# EAGLE schematic pp_mainframe (EAGLE 9.0.0)
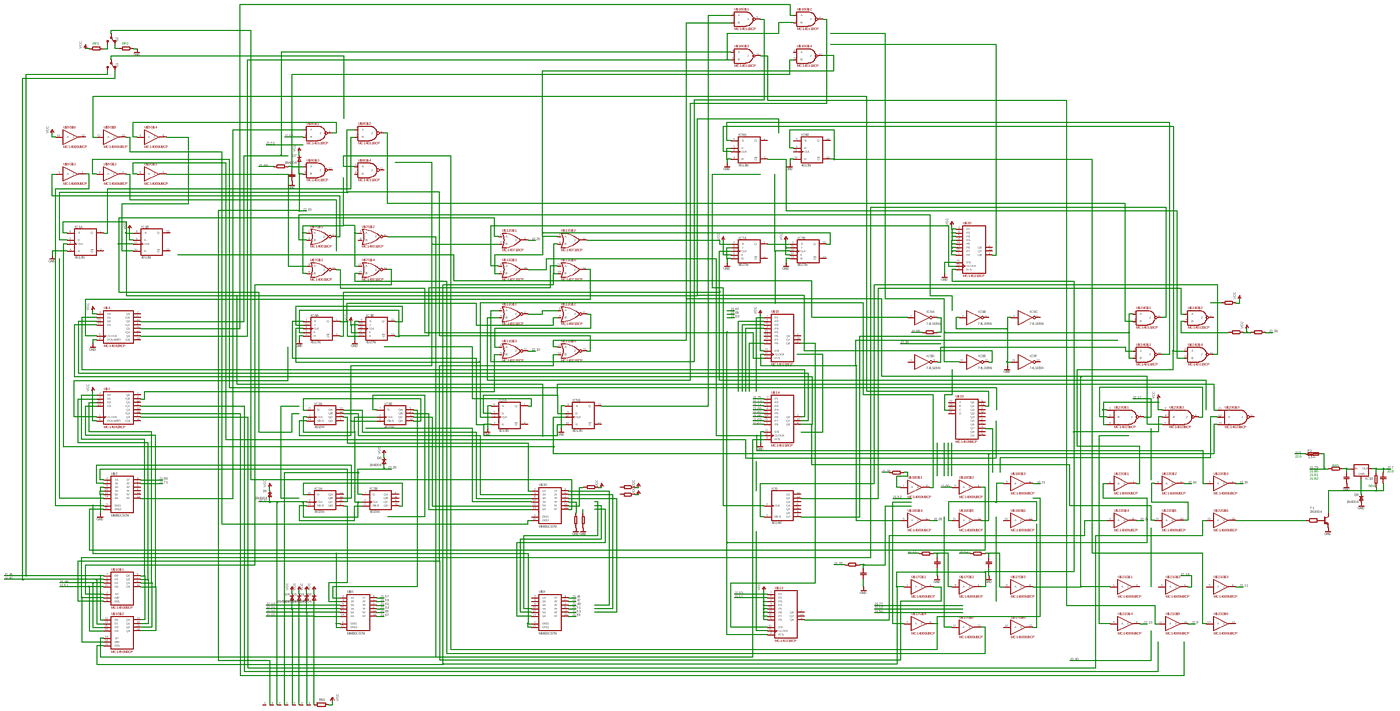
[diagram p0: schematic, sheet 1, overview]
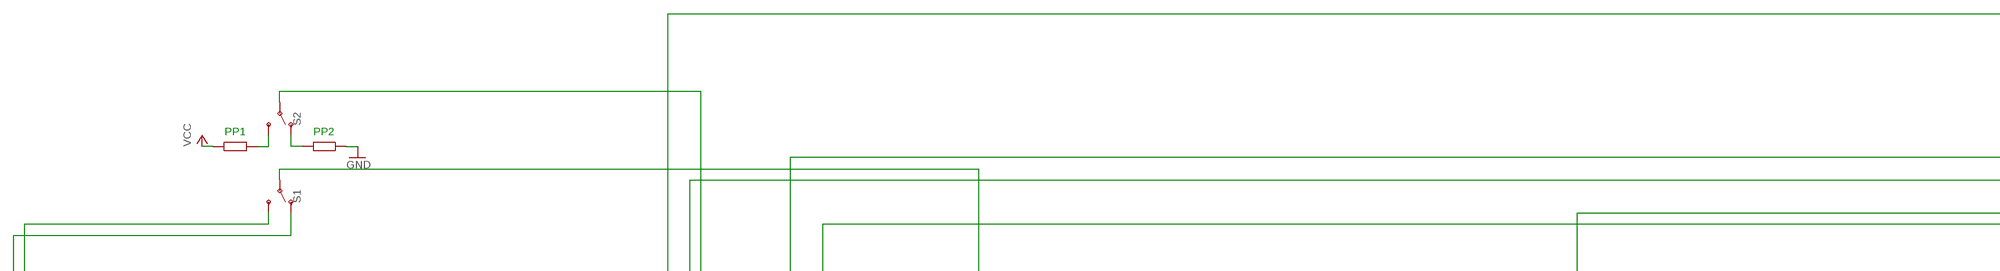
[diagram p1: schematic, sheet 1, part 1 of 5]
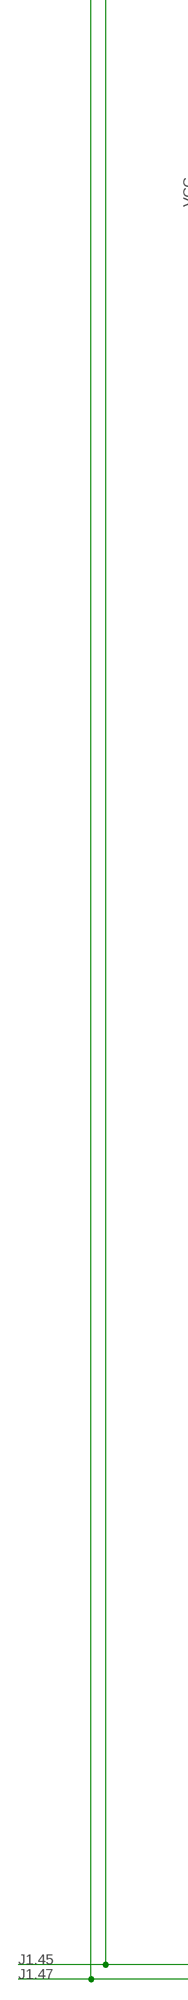
[diagram p2: schematic, sheet 1, part 2 of 5]
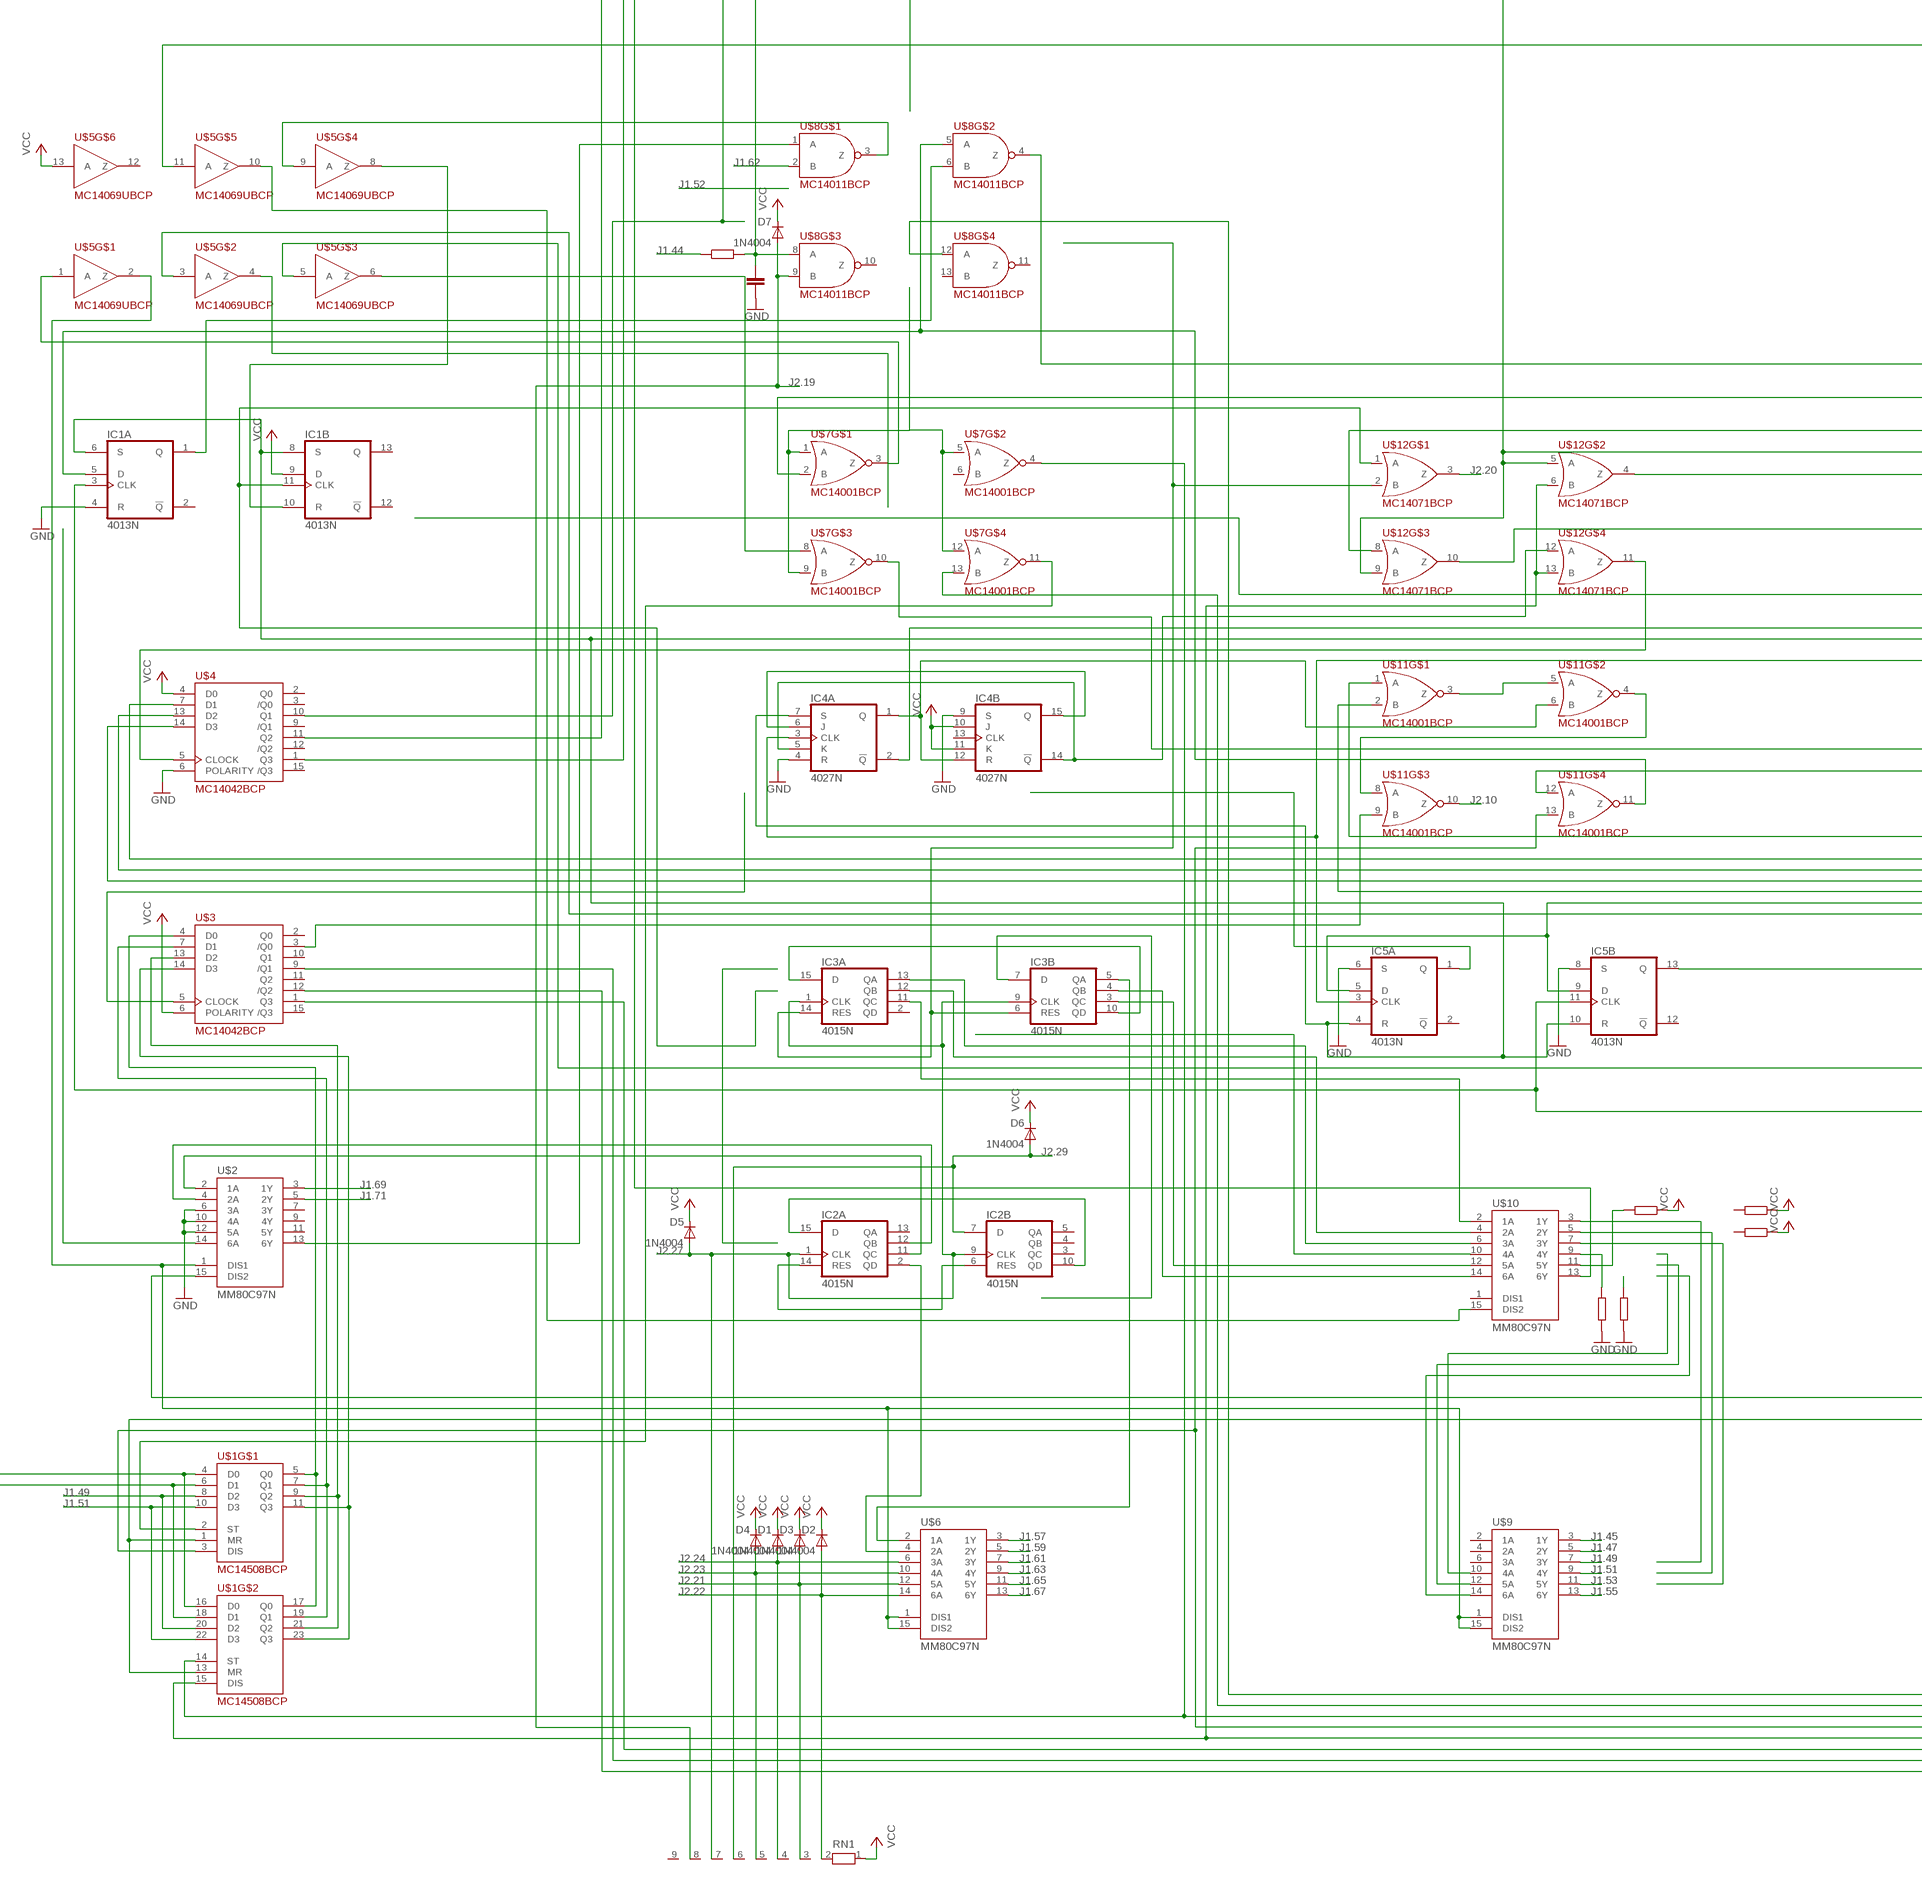
[diagram p3: schematic, sheet 1, part 3 of 5]
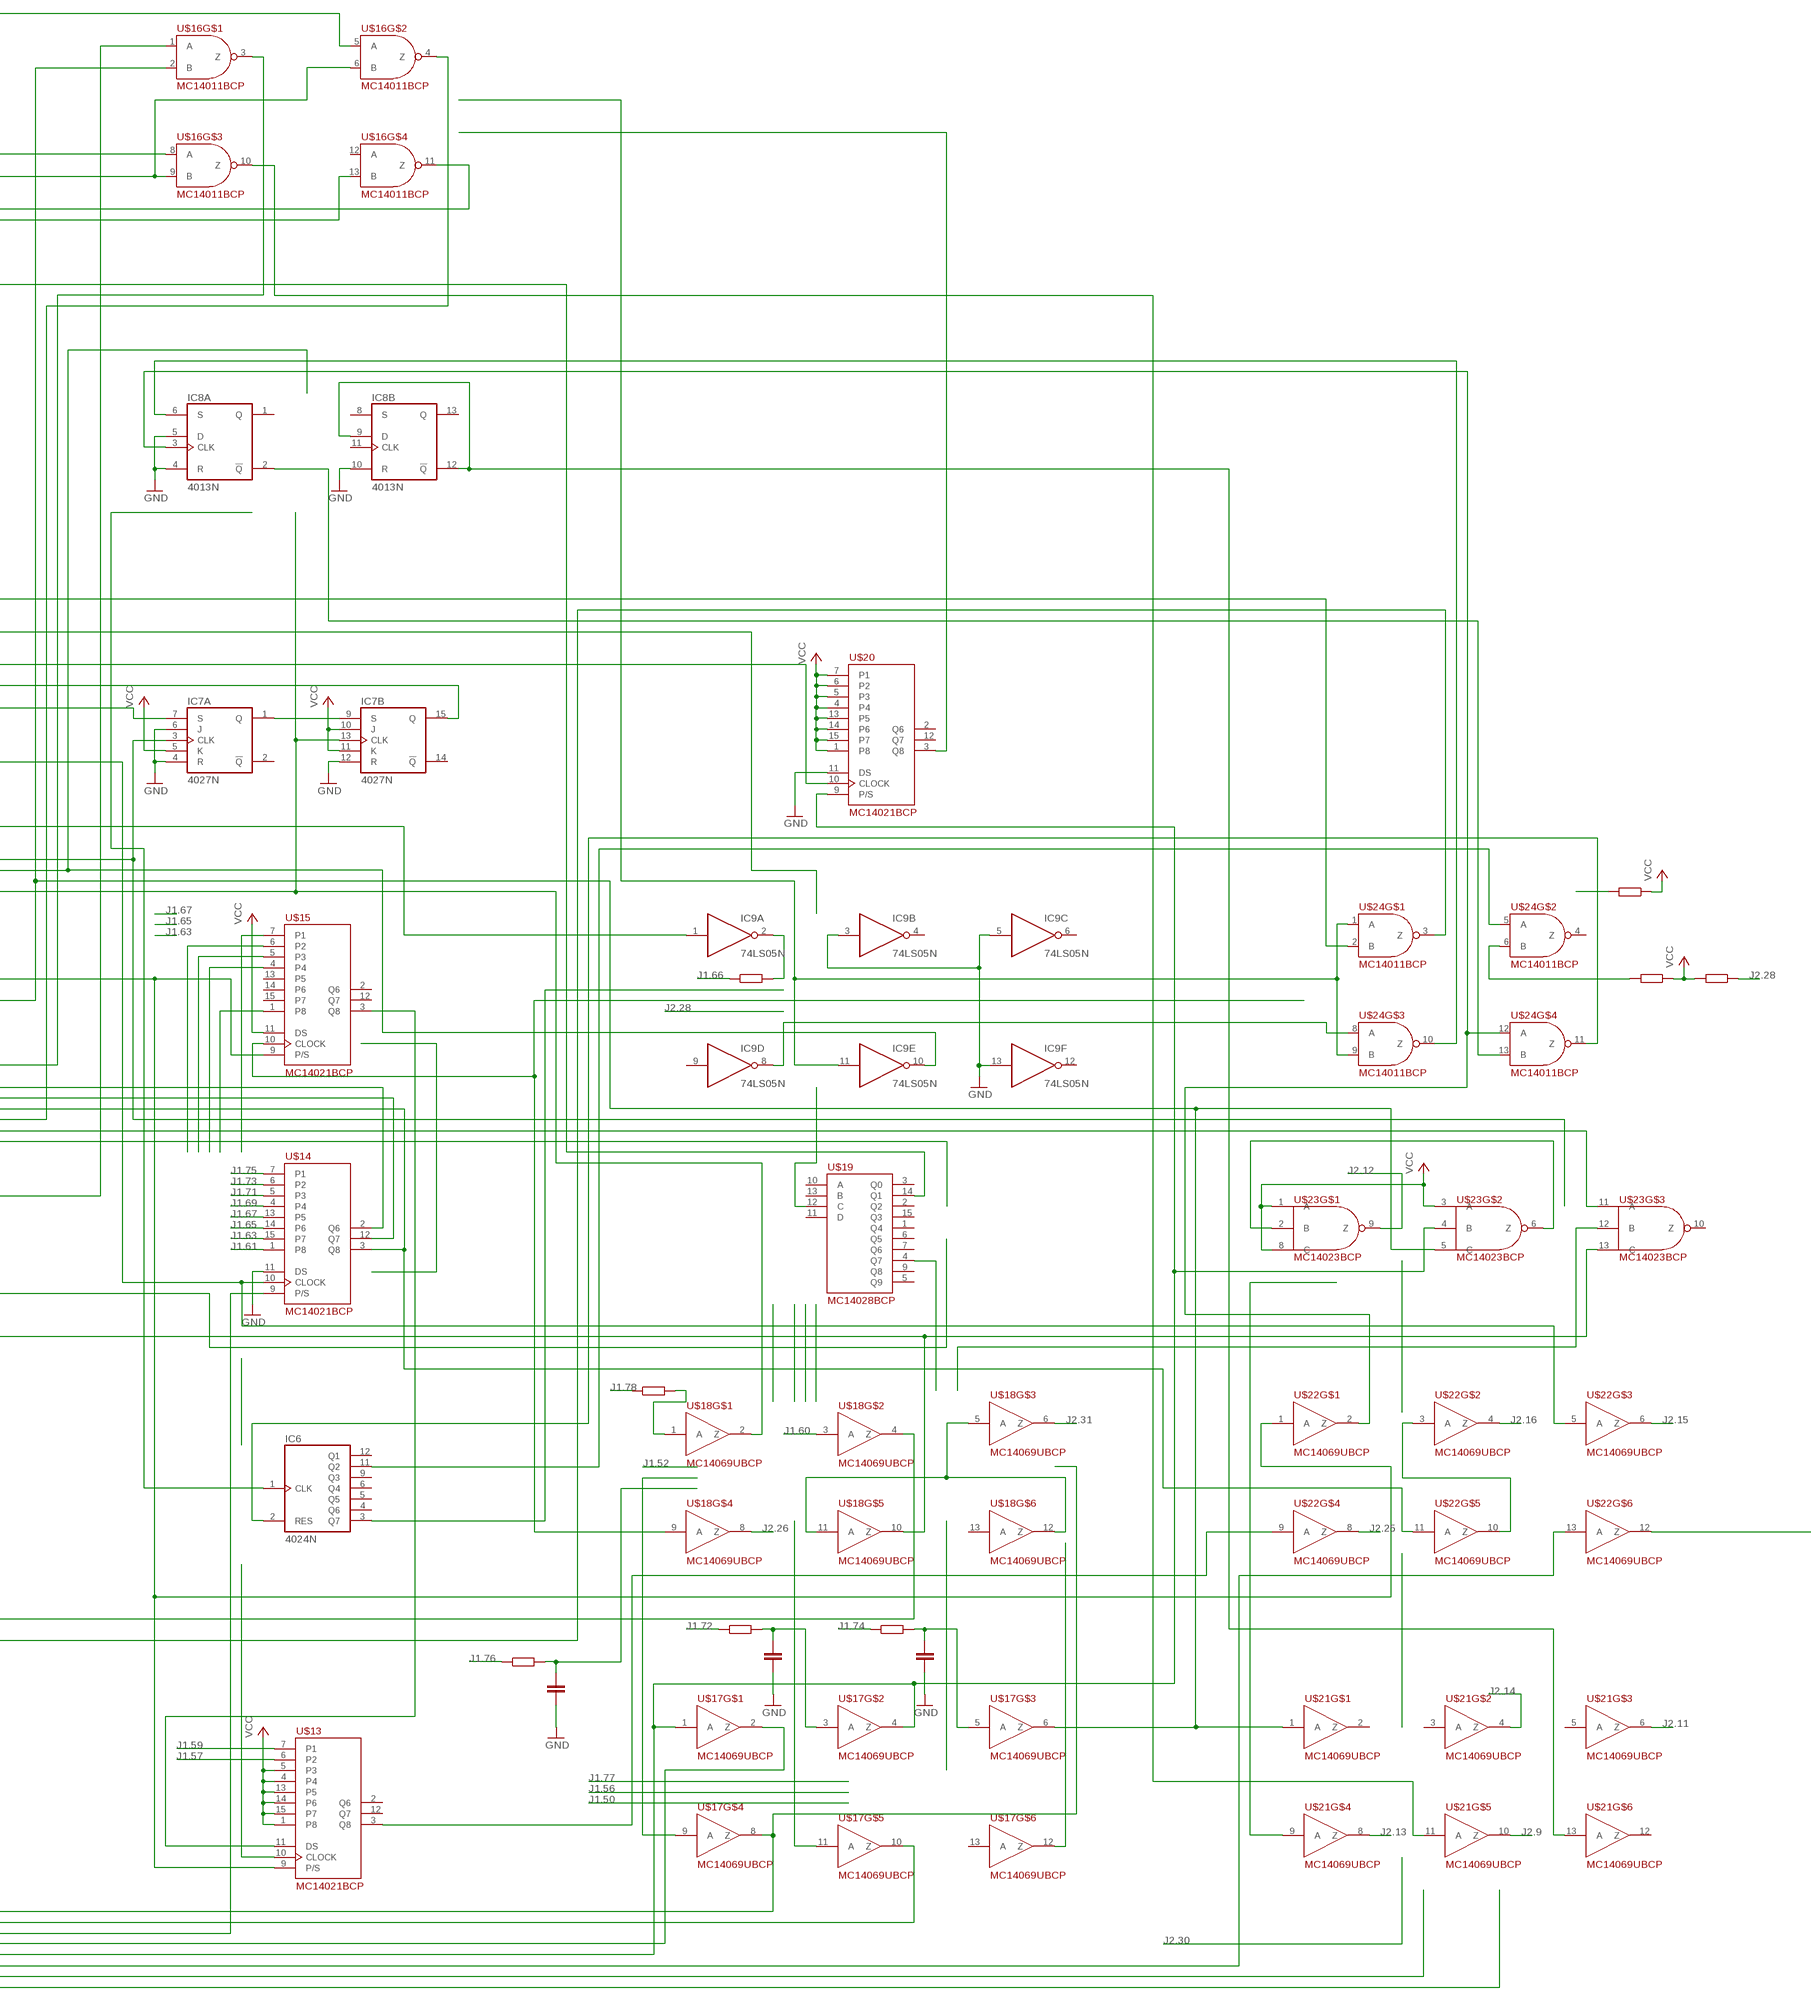
[diagram p4: schematic, sheet 1, part 4 of 5]
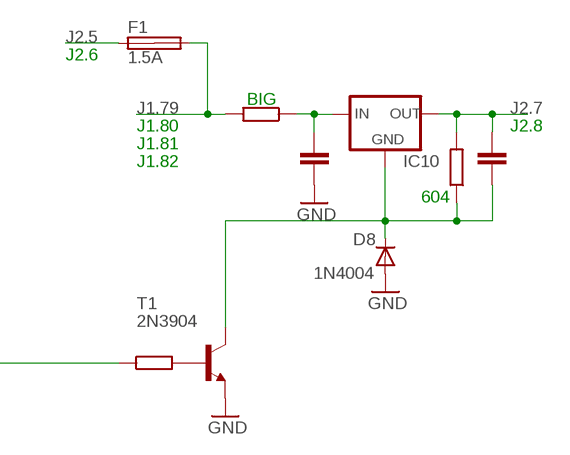
[diagram p5: schematic, sheet 1, part 5 of 5]

## Parts
D1  1N4004  [DO41-10]
D2  1N4004  [DO41-10]
D3  1N4004  [DO41-10]
D4  1N4004  [DO41-10]
D5  1N4004  [DO41-10]
D6  1N4004  [DO41-10]
D7  1N4004  [DO41-10]
D8  1N4004  [DO41-10]
F1  1.5A  SHK20L  [SHK20L]
IC1  4013N  [DIL14]
IC2  4015N  [DIL16]
IC3  4015N  [DIL16]
IC4  4027N  [DIL16]
IC5  4013N  [DIL14]
IC6  4024N  [DIL14]
IC7  4027N  [DIL16]
IC8  4013N  [DIL14]
IC9  74LS05N  [DIL14]
IC10  LM109-TO3  [TO3-K02]
RN1  RN08  [RN-9]
S1  SWITCH-SPDT-PTH-11.6X4.0MM  [SWITCH_SPDT_PTH_11.6X4.0MM]
S2  SWITCH-SPDT-PTH-11.6X4.0MM  [SWITCH_SPDT_PTH_11.6X4.0MM]
T1  2N3904  [TO92]
U$1  MC14508BCP  [DIL24-6]
U$2  MM80C97N  [DIL16]
U$3  MC14042BCP  [DIL16]
U$4  MC14042BCP  [DIL16]
U$5  MC14069UBCP  [DIL14]
U$6  MM80C97N  [DIL16]
U$7  MC14001BCP  [DIL14]
U$8  MC14011BCP  [DIL14]
U$9  MM80C97N  [DIL16]
U$10  MM80C97N  [DIL16]
U$11  MC14001BCP  [DIL14]
U$12  MC14071BCP  [DIL14]
U$13  MC14021BCP  [DIL16]
U$14  MC14021BCP  [DIL16]
U$15  MC14021BCP  [DIL16]
U$16  MC14011BCP  [DIL14]
U$17  MC14069UBCP  [DIL14]
U$18  MC14069UBCP  [DIL14]
U$19  MC14028BCP  [DIL16]
U$20  MC14021BCP  [DIL16]
U$21  MC14069UBCP  [DIL14]
U$22  MC14069UBCP  [DIL14]
U$23  MC14023BCP  [DIL14]
U$24  MC14011BCP  [DIL14]

## Nets
GND: D8.A IC1.4(A:R) IC4.4(A:R) IC4.9(B:S) IC5.6(A:S) IC5.8(B:S) IC7.4(A:R) IC7.6(A:J) IC7.12(B:R) IC8.4(A:R) IC8.5(A:D) IC8.10(B:R) IC9.3(B:I) IC9.5(C:I) IC9.13(F:I) T1.3(E) U$2.6(3A) U$2.10(4A) U$2.12(5A) U$4.6(POLARITY) U$14.11(DS) U$20.11(DS)
J1.45: S1.3(S) U$1.4(D0) U$1.16(D0) U$9.3(1Y)
J1.47: S1.1(O) U$1.6(D1) U$1.18(D1) U$9.5(2Y)
J1.49: U$1.8(D2) U$1.20(D2) U$9.7(3Y)
J1.51: U$1.10(D3) U$1.22(D3) U$9.9(4Y)
J1.53: U$9.11(5Y)
J1.55: U$9.13(6Y)
J1.57: U$6.3(1Y) U$13.6(P2)
J1.59: U$6.5(2Y) U$13.7(P1)
J1.60: U$18.3(A)
J1.61: U$6.7(3Y) U$14.1(P8)
J1.62: U$8.2(B)
J1.63: U$6.9(4Y) U$14.15(P7)
J1.65: U$6.11(5Y) U$14.14(P6)
J1.67: U$6.13(6Y) U$14.13(P5)
J1.69: U$2.3(1Y) U$14.4
J1.71: U$2.5(2Y) U$14.5(P3)
J1.73: U$14.6(P2)
J1.75: U$14.7(P1)
J1.79: F1.2A
J2.5: F1.1A
J2.7: IC10.1(OUT)
J2.9: U$21.10(Z)
J2.10: U$11.10(Z)
J2.11: U$21.6(Z)
J2.12: U$23.9(Z)
J2.13: U$21.8(Z)
J2.14: U$21.4(Z)
J2.15: U$22.6(Z)
J2.16: U$22.4(Z)
J2.19: D7.A RN1.8 U$8.9(B)
J2.20: U$12.3(Z)
J2.21: RN1.3 U$6.12(5A)
J2.22: RN1.2 U$6.14(6A)
J2.23: D4.A RN1.5 U$6.10(4A)
J2.24: D1.A RN1.4 U$6.6(3A)
J2.25: U$22.8(Z)
J2.26: U$18.8(Z)
J2.27: D5.A IC2.1(A:CLK) IC2.9(B:CLK) IC3.1(A:CLK) IC3.9(B:CLK) RN1.7
J2.29: D6.A IC2.7(B:D) RN1.6
J2.31: U$18.6(Z)
N$1: U$1.1(MR) U$1.13(MR) U$24.3(Z)
N$2: U$1.14(ST) U$7.4(Z) U$14.9(P/S)
N$3: U$1.5(Q0) U$1.17(Q0) U$3.4(D0)
N$4: U$1.9(Q2) U$1.21(Q2) U$3.13(D2)
N$5: U$1.7(Q1) U$1.19(Q1) U$3.7(D1)
N$6: IC4.1(A:Q) IC4.12(B:R) U$11.6(B)
N$7: IC4.6(A:J) IC4.15(B:Q)
N$8: S2.2(P) U$10.13(6Y)
N$9: IC4.5(A:K) IC4.14(B:!Q) U$12.12(A)
N$10: U$7.1(A) U$7.5(A) U$7.9(B) U$7.12(A)
N$11: IC1.6(A:S) IC1.8(B:S) IC4.7(A:S) IC5.4(A:R) IC5.10(B:R) IC9.10(E:O)
N$12: U$1.2(ST) U$7.11(Z)
N$13: U$2.1(DIS1) U$5.2(Z) U$6.1(DIS1) U$6.15(DIS2) U$9.1(DIS1) U$9.15(DIS2)
N$14: IC3.5(B:QA) U$6.2(1A)
N$15: IC3.3(B:QC) U$10.12(5A)
N$16: IC2.6(B:RES) IC2.14(A:RES)
N$17: IC2.10(B:QD) IC2.15(A:D)
N$18: IC3.4(B:QB) U$10.14(6A)
N$19: IC3.6(B:RES) IC3.14(A:RES) U$12.2(B)
N$20: IC3.10(B:QD) IC3.15(A:D)
N$21: U$5.5(A)
N$22: IC5.5(A:D) IC5.9(B:D) U$23.11(A)
N$23: U$2.13(6Y) U$8.1(A)
N$24: U$1.11(Q3) U$1.23(Q3) U$3.14(D3)
N$25: U$11.3(Z) U$11.5(A)
N$26: U$11.4(Z) U$11.8(A)
N$27: IC7.15(B:Q) U$12.5(A) U$12.9(B) U$16.11(Z)
N$28: U$2.15(DIS2) U$18.4(Z)
N$29: U$1.3(DIS) U$11.13(B) U$17.2(Z)
N$30: U$1.15(DIS) U$12.6(B) U$12.13(B) U$17.1(A) U$17.4(Z) U$20.9(P/S) U$23.4(B)
N$31: IC2.11(A:QC) U$2.2(1A)
N$32: IC7.1(A:Q) IC7.9(B:S)
N$34: U$2.14(6A)
N$35: IC2.12(A:QB) U$2.4(2A)
N$36: U$3.1(Q3) U$22.13(A)
N$37: U$3.3(/Q0) U$11.9(B)
N$38: U$3.5(CLOCK)
N$39: U$22.12(Z)
N$40: U$4.1(Q3) U$16.6(B) U$16.9(B)
N$41: U$3.9(/Q1)
N$42: U$18.5(A) U$18.11(A) U$18.12(Z)
N$43: U$3.12(/Q2)
N$44: U$4.5(CLOCK) U$12.11(Z)
N$45: U$4.7(D1) U$14.2(Q6)
N$46: U$4.10(Q1) U$16.8(A)
N$47: U$4.11(Q2) U$16.5(A)
N$48: U$4.13(D2) U$14.12(Q7)
N$49: U$22.3(A) U$22.10(Z)
N$50: U$4.14(D3) U$14.3(Q8) U$22.11(A)
N$51: IC1.1(A:Q) U$8.6(B)
N$52: U$17.5(A)
N$53: IC1.3(A:CLK) IC5.11(B:CLK) U$18.10(Z) U$23.13(C)
N$54: U$5.6(Z) U$7.8(A)
N$55: U$5.1(A) U$7.3(Z)
N$56: IC1.5(A:D) U$8.5(A) U$11.11(Z)
N$57: U$5.3(A)
N$58: IC1.10(B:R) U$5.8(Z)
N$59: U$5.4(Z)
N$60: IC1.11(B:CLK) U$12.1(A)
N$61: U$5.9(A) U$8.3(Z)
N$62: U$5.10(Z) U$10.15(DIS2)
N$63: U$5.11(A) U$19.14(Q1)
N$64: IC2.2(A:QD) U$6.4(2A)
N$65: IC3.7(B:D)
N$66: IC3.11(A:QC) U$10.2(1A)
N$67: IC3.12(A:QB) U$10.4(2A)
N$68: IC3.13(A:QA) U$10.6(3A)
N$70: U$10.10(4A)
N$71: IC4.2(A:!Q) IC7.3(A:CLK)
N$72: U$7.13(B) U$17.10(Z)
N$73: IC4.3(A:CLK) IC5.3(A:CLK) IC7.13(B:CLK) U$18.2(Z)
N$74: U$8.4(Z) U$24.2(B)
N$75: U$8.12(A) U$17.8(Z)
N$76: U$8.8(A) U$16.13(B)
N$77: IC5.1(A:Q)
N$78: S1.2(P)
N$79: U$7.2(B)
N$80: U$19.12(C)
N$81: U$7.10(Z) U$13.9(P/S) U$15.9(P/S) U$22.1(A)
N$82: S2.1(O)
N$83: S2.3(S)
N$84: U$9.10(4A)
N$85: U$9.12(5A)
N$86: U$9.14(6A)
N$87: U$10.3(1Y)
N$88: U$10.5(2Y)
N$89: U$10.7(3Y)
N$90: U$10.9(4Y)
N$92: U$10.11(5Y)
N$93: IC5.13(B:Q) U$16.1(A)
N$94: U$11.1(A) U$16.3(Z)
N$95: U$11.2(B) U$16.4(Z)
N$96: U$11.12(A) U$16.2(B) U$17.6(Z) U$21.1(A) U$23.5(C)
N$97: IC7.7(A:S) U$12.4(Z)
N$98: U$12.8(A) U$20.10(CLOCK)
N$99: U$12.10(Z) U$14.10(CLOCK) U$22.5(A)
N$100: U$13.11(DS) U$15.3(Q8)
N$101: U$13.3(Q8) U$22.9(A)
N$102: U$13.10(CLOCK)
N$104: U$15.7(P1)
N$105: IC6.1(CLK)
N$106: IC6.2(RES) U$24.11(Z)
N$107: IC6.3(Q7)
N$108: IC6.11(Q2) U$24.5(A)
N$109: U$15.1(P8)
N$110: U$15.4
N$111: U$15.5(P3)
N$112: U$15.6(P2)
N$113: U$15.10(CLOCK) U$18.9(A)
N$114: IC8.2(A:!Q) U$24.13(B)
N$115: IC8.3(A:CLK) U$22.2(Z) U$24.12(A)
N$116: U$17.9(A)
N$117: IC8.6(A:S) U$24.10(Z)
N$119: U$16.10(Z) U$21.11(A)
N$120: U$20.3(Q8)
N$121: IC9.11(E:I) U$24.1(A) U$24.9(B)
N$122: U$17.3(A)
N$123: U$17.11(A)
N$124: U$17.12(Z)
N$125: U$18.1(A)
N$128: U$23.12(B)
N$129: U$19.4(Q7)
N$133: IC9.1(A:I)
N$134: IC9.2(A:O)
N$135: IC9.8(D:O) U$24.8(A)
N$136: U$21.9(A)
N$139: IC8.9(B:D) IC8.12(B:!Q) U$21.13(A)
N$140: U$24.6(B)
N$141: D8.C IC10.3(GND) T1.1(C)
N$142: U$23.2(B) U$23.6(Z)
N$143: IC10.2(IN)
VCC: D1.C D2.C D3.C D4.C D5.C D6.C D7.C IC1.9(B:D) IC4.10(B:J) IC4.11(B:K) IC7.5(A:K) IC7.10(B:J) IC7.11(B:K) RN1.1 U$3.6(POLARITY) U$4.4(D0) U$5.13(A) U$13.1(P8) U$13.4 U$13.5(P3) U$13.13(P5) U$13.14(P6) U$13.15(P7) U$15.11(DS) U$20.1(P8) U$20.4 U$20.5(P3) U$20.6(P2) U$20.7(P1) U$20.13(P5) U$20.14(P6) U$20.15(P7) U$23.1(A) U$23.3(A) U$23.8(C)
Unconnected: D2.A D3.A F1.1B F1.2B IC1.2(A:!Q) IC1.12(B:!Q) IC1.13(B:Q) IC2.3(B:QC) IC2.4(B:QB) IC2.5(B:QA) IC2.13(A:QA) IC3.2(A:QD) IC4.13(B:CLK) IC5.2(A:!Q) IC5.12(B:!Q) IC6.4(Q6) IC6.5(Q5) IC6.6(Q4) IC6.9(Q3) IC6.12(Q1) IC7.2(A:!Q) IC7.14(B:!Q) IC8.1(A:Q) IC8.8(B:S) IC8.11(B:CLK) IC8.13(B:Q) IC9.4(B:O) IC9.6(C:O) IC9.9(D:I) IC9.12(F:O) RN1.9 T1.2(B) U$2.7(3Y) U$2.9(4Y) U$2.11(5Y) U$3.2(Q0) U$3.10(Q1) U$3.11(Q2) U$3.15(/Q3) U$4.2(Q0) U$4.3(/Q0) U$4.9(/Q1) U$4.12(/Q2) U$4.15(/Q3) U$5.12(Z) U$7.6(B) U$8.10(Z) U$8.11(Z) U$8.13(B) U$9.2(1A) U$9.4(2A) U$9.6(3A) U$10.1(DIS1) U$13.2(Q6) U$13.12(Q7) U$15.2(Q6) U$15.12(Q7) U$15.13(P5) U$15.14(P6) U$15.15(P7) U$16.12(A) U$17.13(A) U$18.13(A) U$19.1(Q4) U$19.2(Q2) U$19.3(Q0) U$19.5(Q9) U$19.6(Q5) U$19.7(Q6) U$19.9(Q8) U$19.10(A) U$19.11(D) U$19.13(B) U$19.15(Q3) U$20.2(Q6) U$20.12(Q7) U$21.2(Z) U$21.3(A) U$21.5(A) U$21.12(Z) U$23.10(Z) U$24.4(Z)

## Notes on the sheet
- PP1 | PP2
- J2.6
- BIG
- J1.80 | J2.8
- J1.81
- J1.82
- 604

## Power pins joined to a net without a drawn wire
GND: IC9.7(P:GND)
VCC: IC9.14(P:VCC)
VDD: IC1.14(P:VDD) IC2.16(P:VDD) IC3.16(P:VDD) IC4.16(P:VDD) IC5.14(P:VDD) IC6.14(VDD) IC7.16(P:VDD) IC8.14(P:VDD)
VSS: IC1.7(P:VSS) IC2.8(P:VSS) IC3.8(P:VSS) IC4.8(P:VSS) IC5.7(P:VSS) IC6.7(VSS) IC7.8(P:VSS) IC8.7(P:VSS)

## Library data of the parts
D1-D8 = diode:1N4004: DIODE general purpose rectifier, 1 A
F1 = fuse:SHK20L: FUSE HOLDER 5 x 20 mm, SH contact, SHH1 Schukat, E1073 Buerklin; OC_FARNELL: unknown; OC_NEWARK: unknown
IC1 IC5 IC8 = 40xx:4013: Dual D FLIP FLOP, set/reset
IC2 IC3 = 40xx:4015: Dual 4-bit static SHIFT REGISTER
IC4 IC7 = 40xx:4027: Dual JK FLIP FLOP
IC6 = 40xx:4024: 7-stage binary/ripple COUNTER
IC9 = 74xx-us:74*05: Hex INVERTER, open collector
IC10 = v-reg:LM109-TO3: VOLTAGE REGULATOR
RN1 = resistor-net:RN08: RESISTOR NETWORK; OC_FARNELL: unknown; OC_NEWARK: unknown
S1 S2 = SparkFun-Switches:SWITCH-SPDT: Single Pole, Double Throw (SPDT) Switch Single-pole, double-throw (SPDT) switch. Variant Overview SMD-AYZ0202 Surface Mount DPDT Switch <https://www.sparkfun.com/products/597> (COM-00597) Used on e.g. LilyPad Arduino USB - ATmega32U4 Board <https://www.sparkfun.com/products/12049> PTH-11.6X4.0MM SPDT Mini Power Switch <https://www.sparkfun.com/products/102> (COM-00102) Used on e.g. SparkFun Simon Says - Through-Hole Soldering Kit <https://www.sparkfun.com/products/10547> (KIT-10547) PTH-11.6X4.0MM-KIT KIT version of SPDT Mini Power Switch - Simplifies soldering by removing tStop of switch pins - only one side can be soldered. PTH-11.6X4.0MM-LOCK LOCK version of SPDT Mini Power Switch - Offset pins hold switch in place for easier soldering. SMD-RIGHT-ANGLE Surface Mount Right Angle Switch <https://www.sparkfun.com/products/10860> (COM-10860) Used on e.g. SparkFun ESP8266 Thing <https://www.sparkfun.com/products/13231>; PROD_ID: SWCH-08261; SF_SKU: COM-00102
T1 = transistor:2N3904: NPN TRANSISTOR
U$1 = User-Submitted:MC14508BCP
U$2 U$6 U$9 U$10 = User-Submitted:MM80C97N
U$3 U$4 = User-Submitted:MC14042BCP
U$5 U$17 U$18 U$21 U$22 = User-Submitted:MC14069UBCP
U$7 U$11 = User-Submitted:MC14001BCP
U$8 U$16 U$24 = User-Submitted:MC14011BCP
U$12 = User-Submitted:MC14071BCP
U$13-U$15 U$20 = User-Submitted:MC14021BCP
U$19 = User-Submitted:MC14028BCP
U$23 = User-Submitted:MC14023BCP